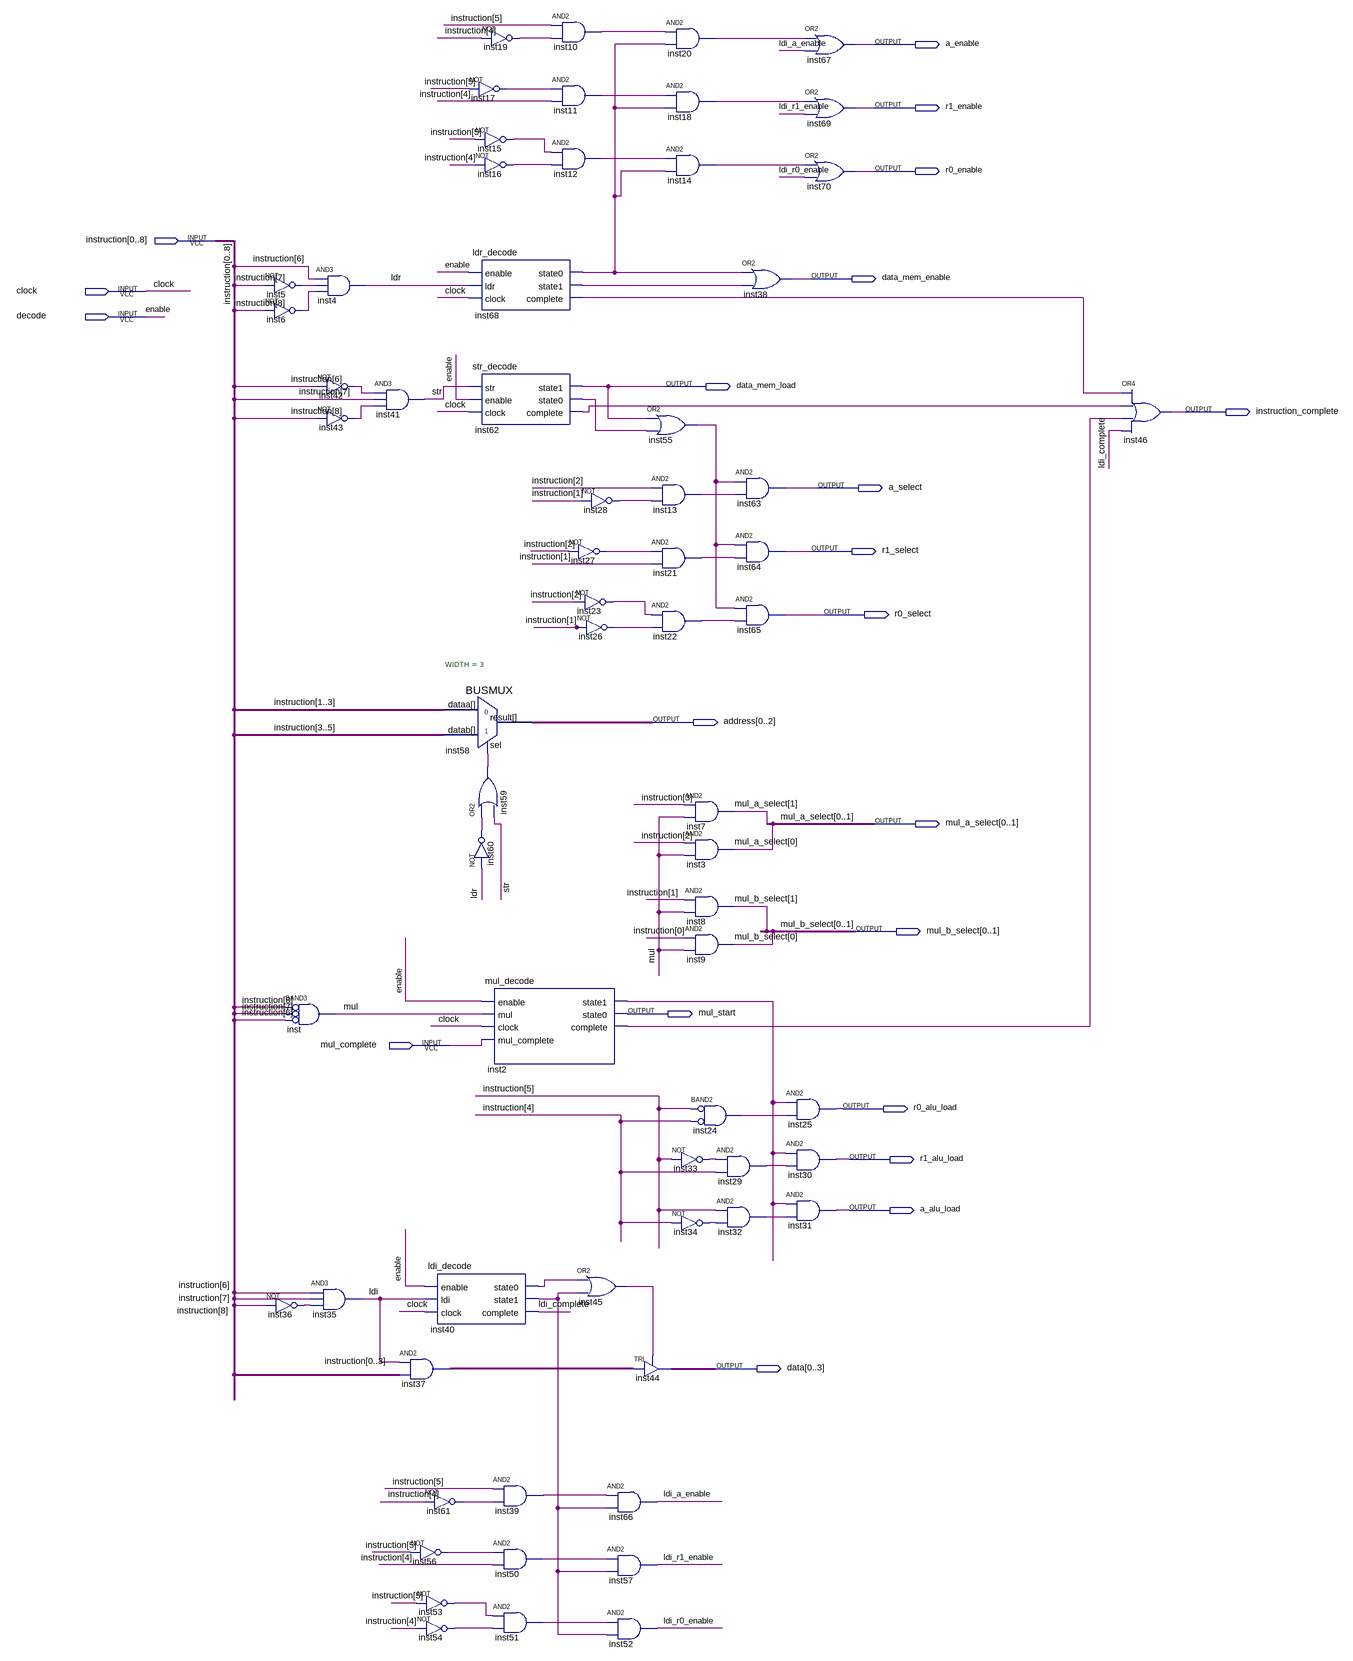
[diagram p0: schematic sheet]
// Quartus schematic instruction_decode.bdf as structural Verilog: 67 symbols, 21 pins
module instruction_decode (
  input  [0:8] instruction,
  input  clock,
  input  decode,
  input  mul_complete,
  output a_enable,
  output r1_enable,
  output r0_enable,
  output data_mem_enable,
  output data_mem_load,
  output instruction_complete,
  output a_select,
  output r1_select,
  output r0_select,
  output [0:2] address,
  output [0:1] mul_a_select,
  output [0:1] mul_b_select,
  output mul_start,
  output r0_alu_load,
  output r1_alu_load,
  output a_alu_load,
  output [0:3] data
);

  wire inst2_complete, inst2_state1, inst5_out, inst6_out, inst10_out, inst11_out, inst12_out, inst13_out,
       inst14_out, inst15_out, inst16_out, inst17_out, inst18_out, inst19_out, inst20_out, inst21_out,
       inst22_out, inst23_out, inst24_out, inst26_out, inst27_out, inst28_out, inst29_out, inst32_out,
       inst33_out, inst34_out, inst36_out, inst39_out, inst40_state0, inst40_state1, inst42_out, inst43_out,
       inst45_out, inst50_out, inst51_out, inst53_out, inst54_out, inst55_out, inst56_out, inst59_out,
       inst60_out, inst61_out, inst62_complete, inst62_state0, inst68_complete, inst68_state0, inst68_state1,
       ldi, ldi_a_enable, ldi_complete, ldi_r0_enable, ldi_r1_enable, ldr, mul, str;
  wire [3:0] inst37_out;

  not inst5 (inst5_out, instruction[7]);
  not inst6 (inst6_out, instruction[8]);
  and inst (mul, ~instruction[8], ~instruction[7], ~instruction[6]);  // BAND3
  not inst36 (inst36_out, instruction[8]);
  and inst4 (ldr, instruction[6], inst5_out, inst6_out);
  not inst42 (inst42_out, instruction[6]);
  not inst43 (inst43_out, instruction[8]);
  and inst35 (ldi, instruction[6], instruction[7], inst36_out);
  and inst41 (str, inst42_out, instruction[7], inst43_out);
  assign inst37_out = {4{ldi}} & instruction[0:3];  // AND2 inst37, 4 bits wide
  not inst56 (inst56_out, instruction[5]);
  BUSMUX #(.WIDTH(3)) inst58 (.datab(instruction[3:5]), .sel(inst59_out), .dataa(instruction[1:3]), .result(address));
  ldi_decode inst40 (
    .enable(decode), .ldi(ldi), .clock(clock), .state0(inst40_state0), .state1(inst40_state1),
    .complete(ldi_complete));
  not inst61 (inst61_out, instruction[4]);
  not inst53 (inst53_out, instruction[5]);
  not inst54 (inst54_out, instruction[4]);
  not inst19 (inst19_out, instruction[4]);
  not inst17 (inst17_out, instruction[5]);
  not inst15 (inst15_out, instruction[5]);
  not inst16 (inst16_out, instruction[4]);
  ldr_decode inst68 (
    .enable(decode), .ldr(ldr), .clock(clock), .state0(inst68_state0), .state1(inst68_state1),
    .complete(inst68_complete));
  str_decode inst62 (
    .str(str), .enable(decode), .clock(clock), .state1(data_mem_load), .state0(inst62_state0),
    .complete(inst62_complete));
  or inst59 (inst59_out, inst60_out, str);
  not inst60 (inst60_out, ldr);
  mul_decode inst2 (
    .enable(decode), .mul(mul), .clock(clock), .mul_complete(mul_complete), .state1(inst2_state1),
    .state0(mul_start), .complete(inst2_complete));
  and inst39 (inst39_out, instruction[5], inst61_out);
  and inst50 (inst50_out, inst56_out, instruction[4]);
  and inst51 (inst51_out, inst53_out, inst54_out);
  and inst10 (inst10_out, instruction[5], inst19_out);
  and inst11 (inst11_out, inst17_out, instruction[4]);
  and inst12 (inst12_out, inst15_out, inst16_out);
  not inst28 (inst28_out, instruction[1]);
  not inst27 (inst27_out, instruction[2]);
  not inst23 (inst23_out, instruction[2]);
  not inst26 (inst26_out, instruction[1]);
  or inst45 (inst45_out, inst40_state0, inst40_state1);
  and inst66 (ldi_a_enable, inst39_out, inst40_state1);
  and inst57 (ldi_r1_enable, inst50_out, inst40_state1);
  and inst52 (ldi_r0_enable, inst51_out, inst40_state1);
  or inst55 (inst55_out, data_mem_load, inst62_state0);
  and inst13 (inst13_out, instruction[2], inst28_out);
  and inst21 (inst21_out, inst27_out, instruction[1]);
  and inst22 (inst22_out, inst23_out, inst26_out);
  TRI inst44[3:0] (.IN(inst37_out), .OE(inst45_out), .OUT(data));
  and inst20 (inst20_out, inst10_out, inst68_state0);
  and inst18 (inst18_out, inst11_out, inst68_state0);
  and inst14 (inst14_out, inst12_out, inst68_state0);
  and inst7 (mul_a_select[1], instruction[3], mul);
  and inst3 (mul_a_select[0], instruction[2], mul);
  and inst8 (mul_b_select[1], instruction[1], mul);
  and inst9 (mul_b_select[0], instruction[0], mul);
  and inst24 (inst24_out, ~instruction[5], ~instruction[4]);  // BAND2
  not inst33 (inst33_out, instruction[5]);
  not inst34 (inst34_out, instruction[4]);
  or inst38 (data_mem_enable, inst68_state0, inst68_state1);
  and inst63 (a_select, inst55_out, inst13_out);
  and inst64 (r1_select, inst55_out, inst21_out);
  and inst65 (r0_select, inst55_out, inst22_out);
  and inst29 (inst29_out, inst33_out, instruction[4]);
  and inst32 (inst32_out, instruction[5], inst34_out);
  or inst67 (a_enable, inst20_out, ldi_a_enable);
  or inst69 (r1_enable, inst18_out, ldi_r1_enable);
  or inst70 (r0_enable, inst14_out, ldi_r0_enable);
  and inst25 (r0_alu_load, inst2_state1, inst24_out);
  and inst30 (r1_alu_load, inst2_state1, inst29_out);
  and inst31 (a_alu_load, inst2_state1, inst32_out);
  or inst46 (instruction_complete, inst68_complete, inst62_complete, inst2_complete, ldi_complete);

  // Other names for the same wires on the sheet: enable = decode
endmodule
